# EAGLE schematic teensy-jst_01.2 v7 (EAGLE 9.7.0)
Assembly variants: DNP
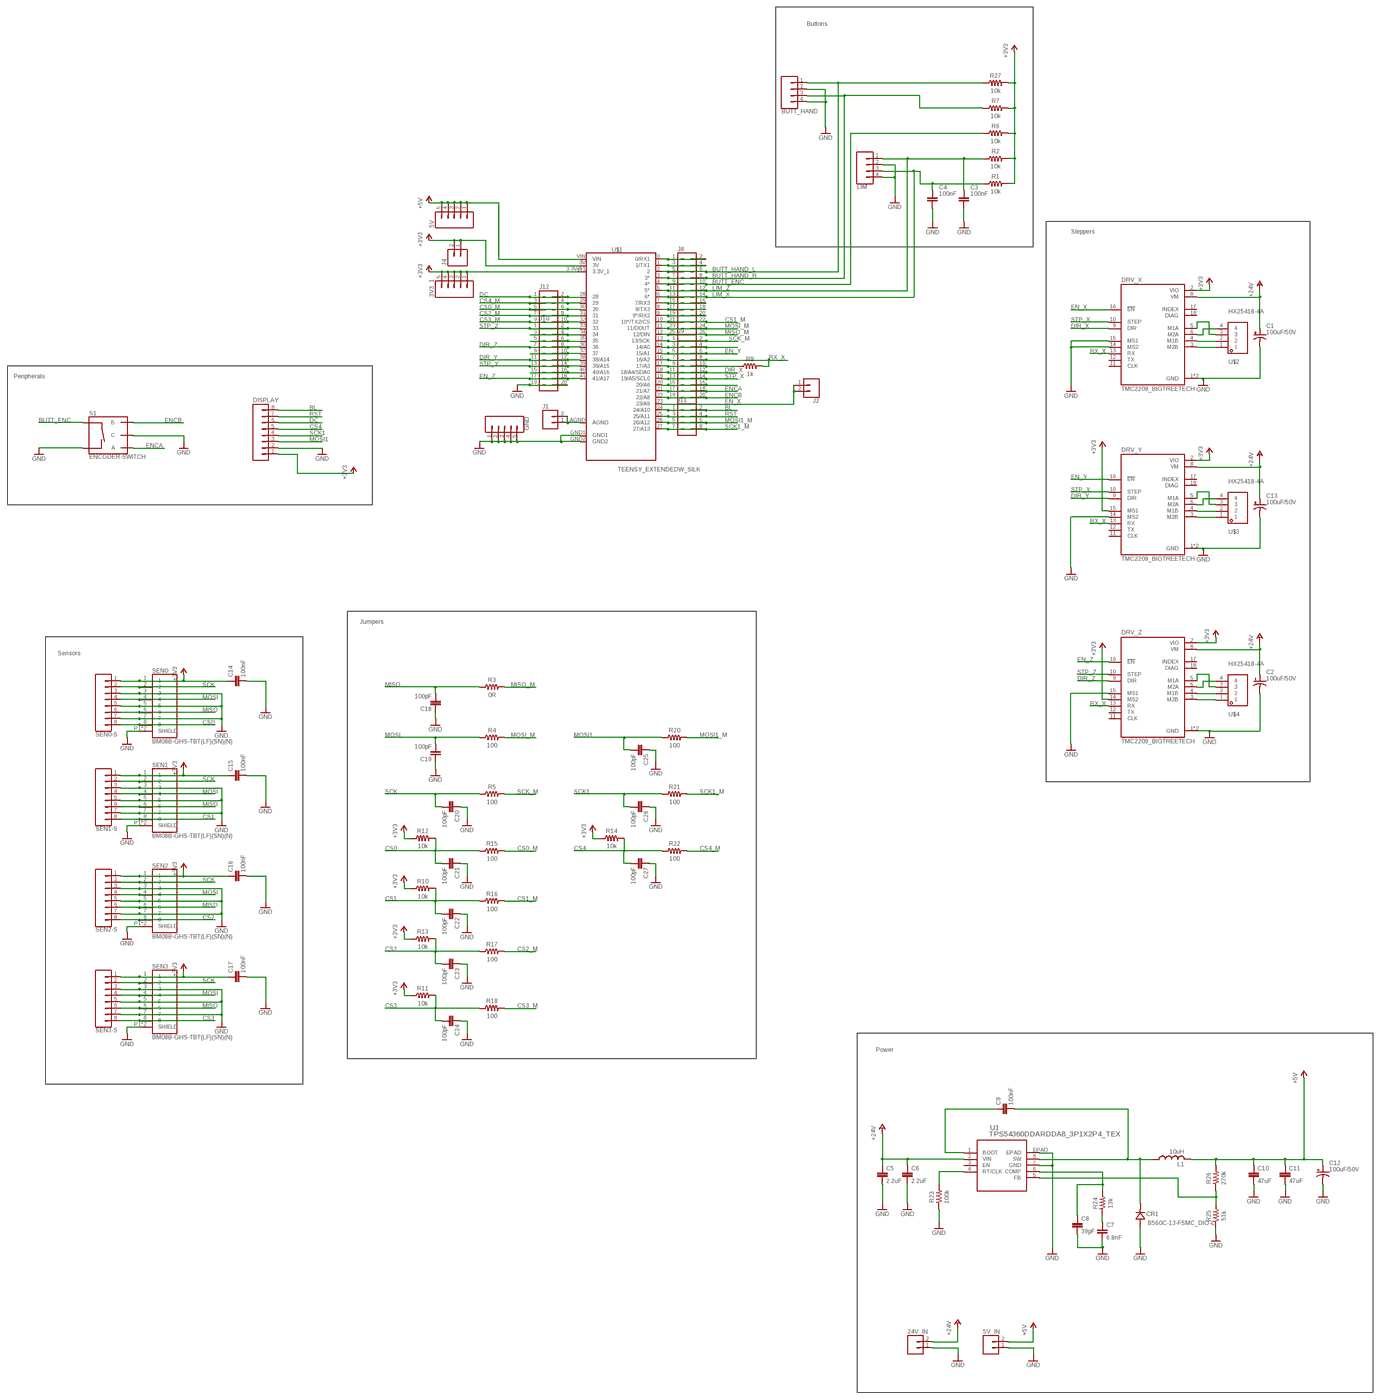
[diagram p0: schematic, sheet 1, overview]
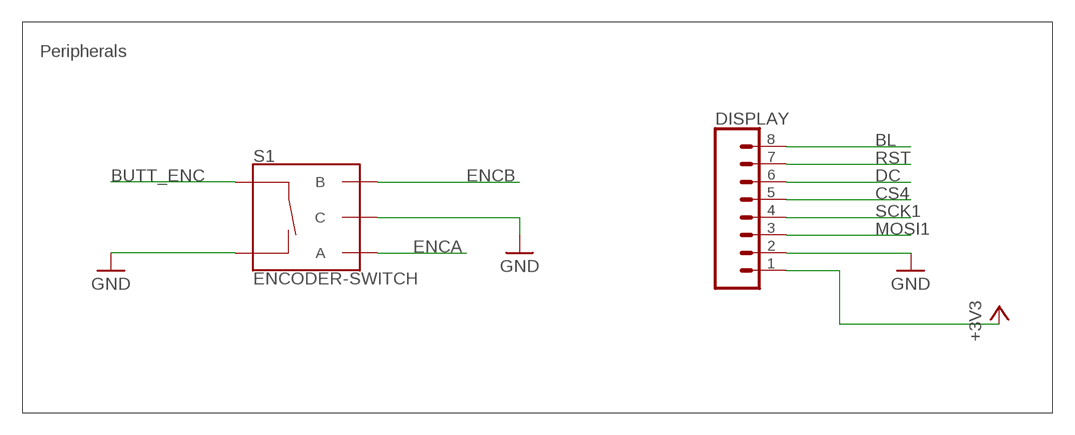
[diagram p1: schematic, sheet 1, part 1 of 4]
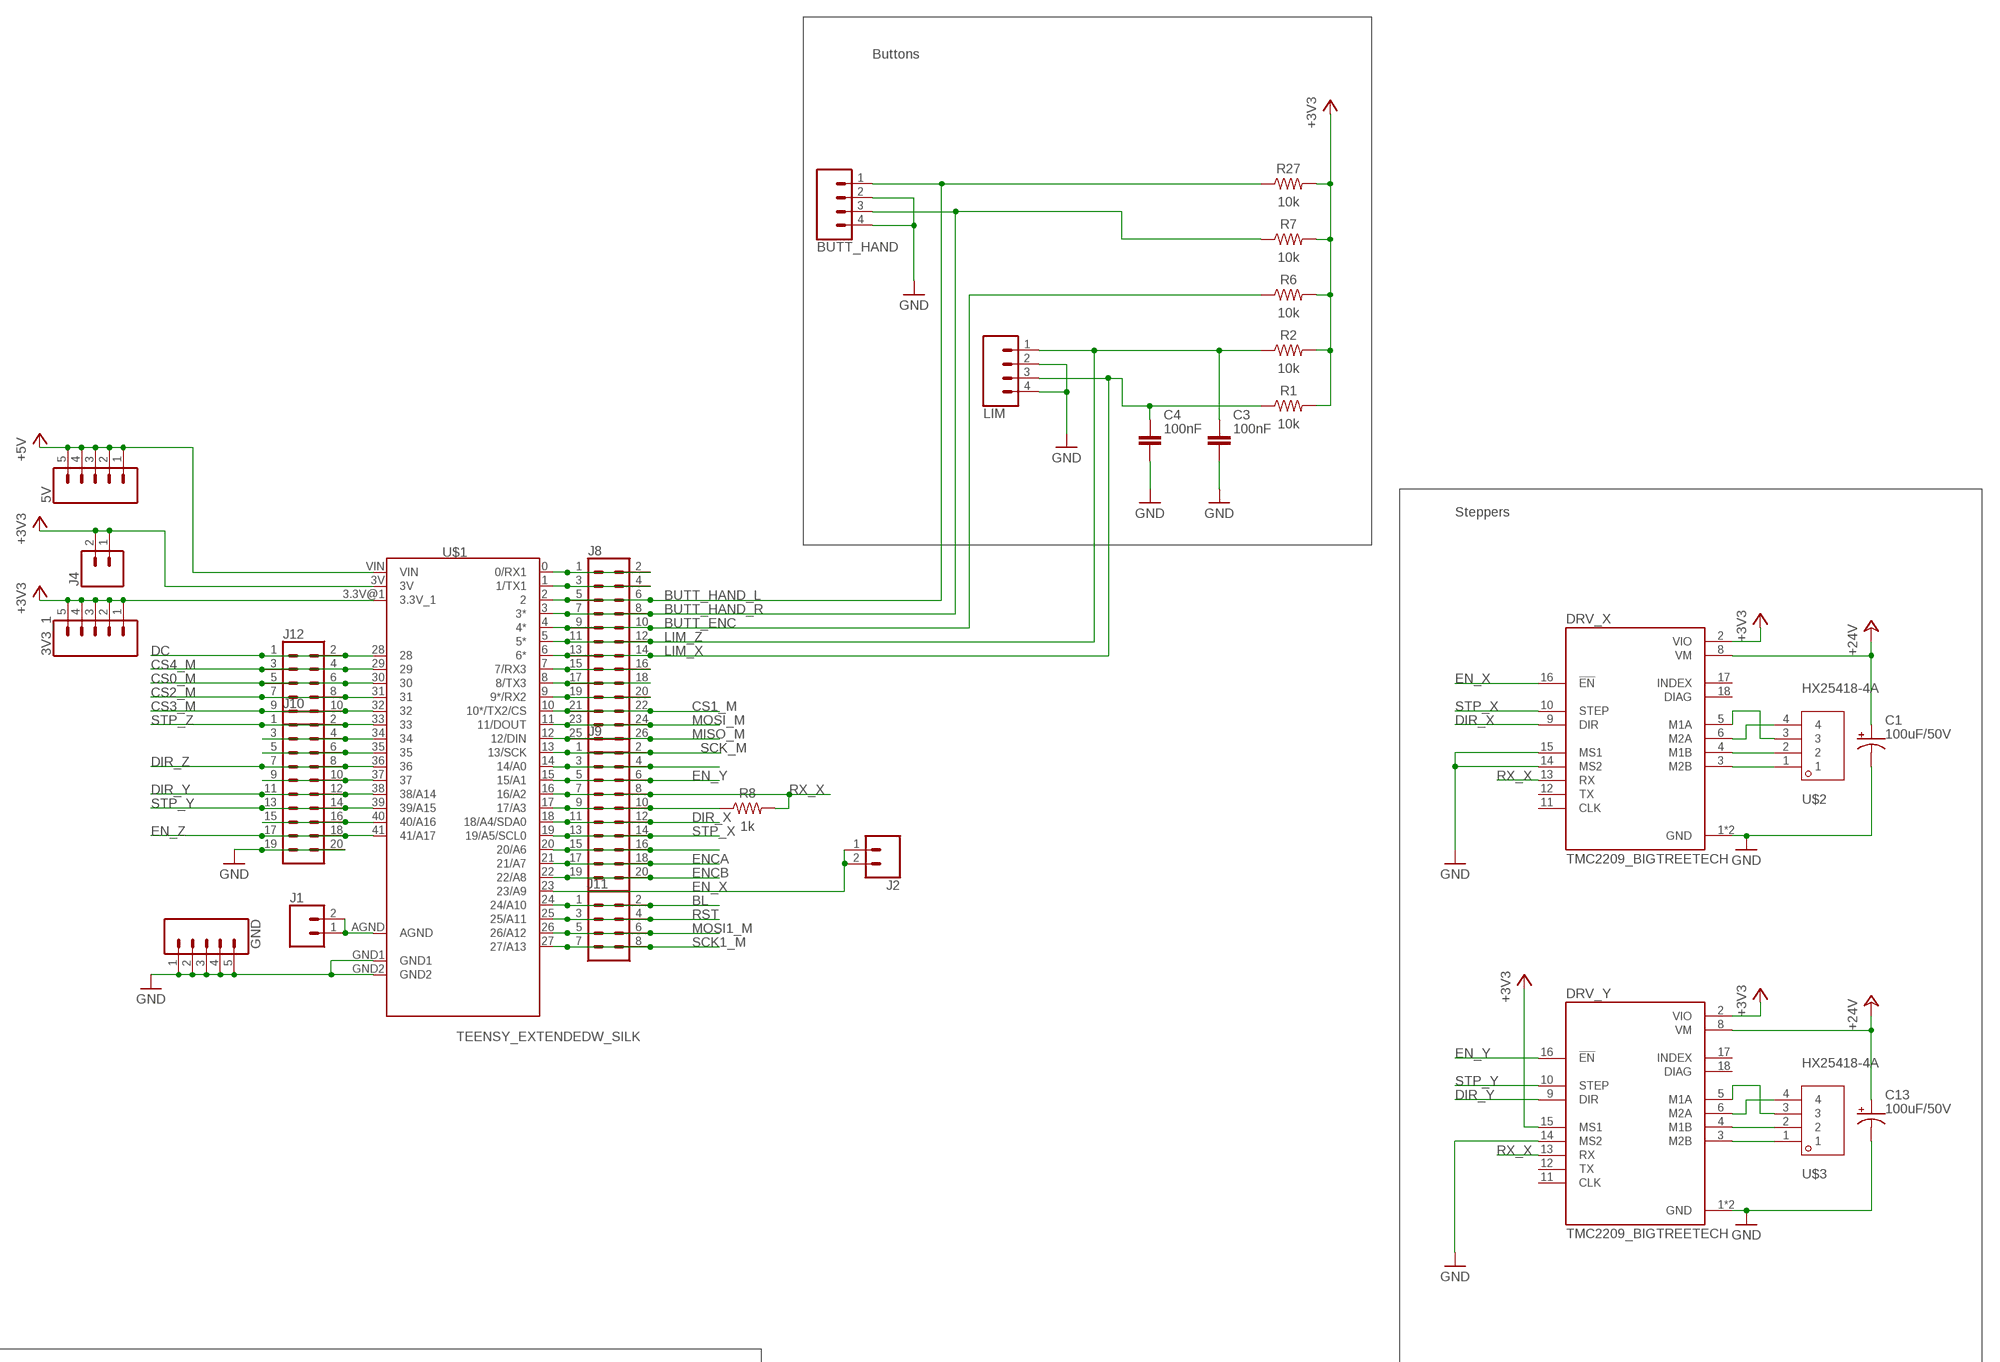
[diagram p2: schematic, sheet 1, part 2 of 4]
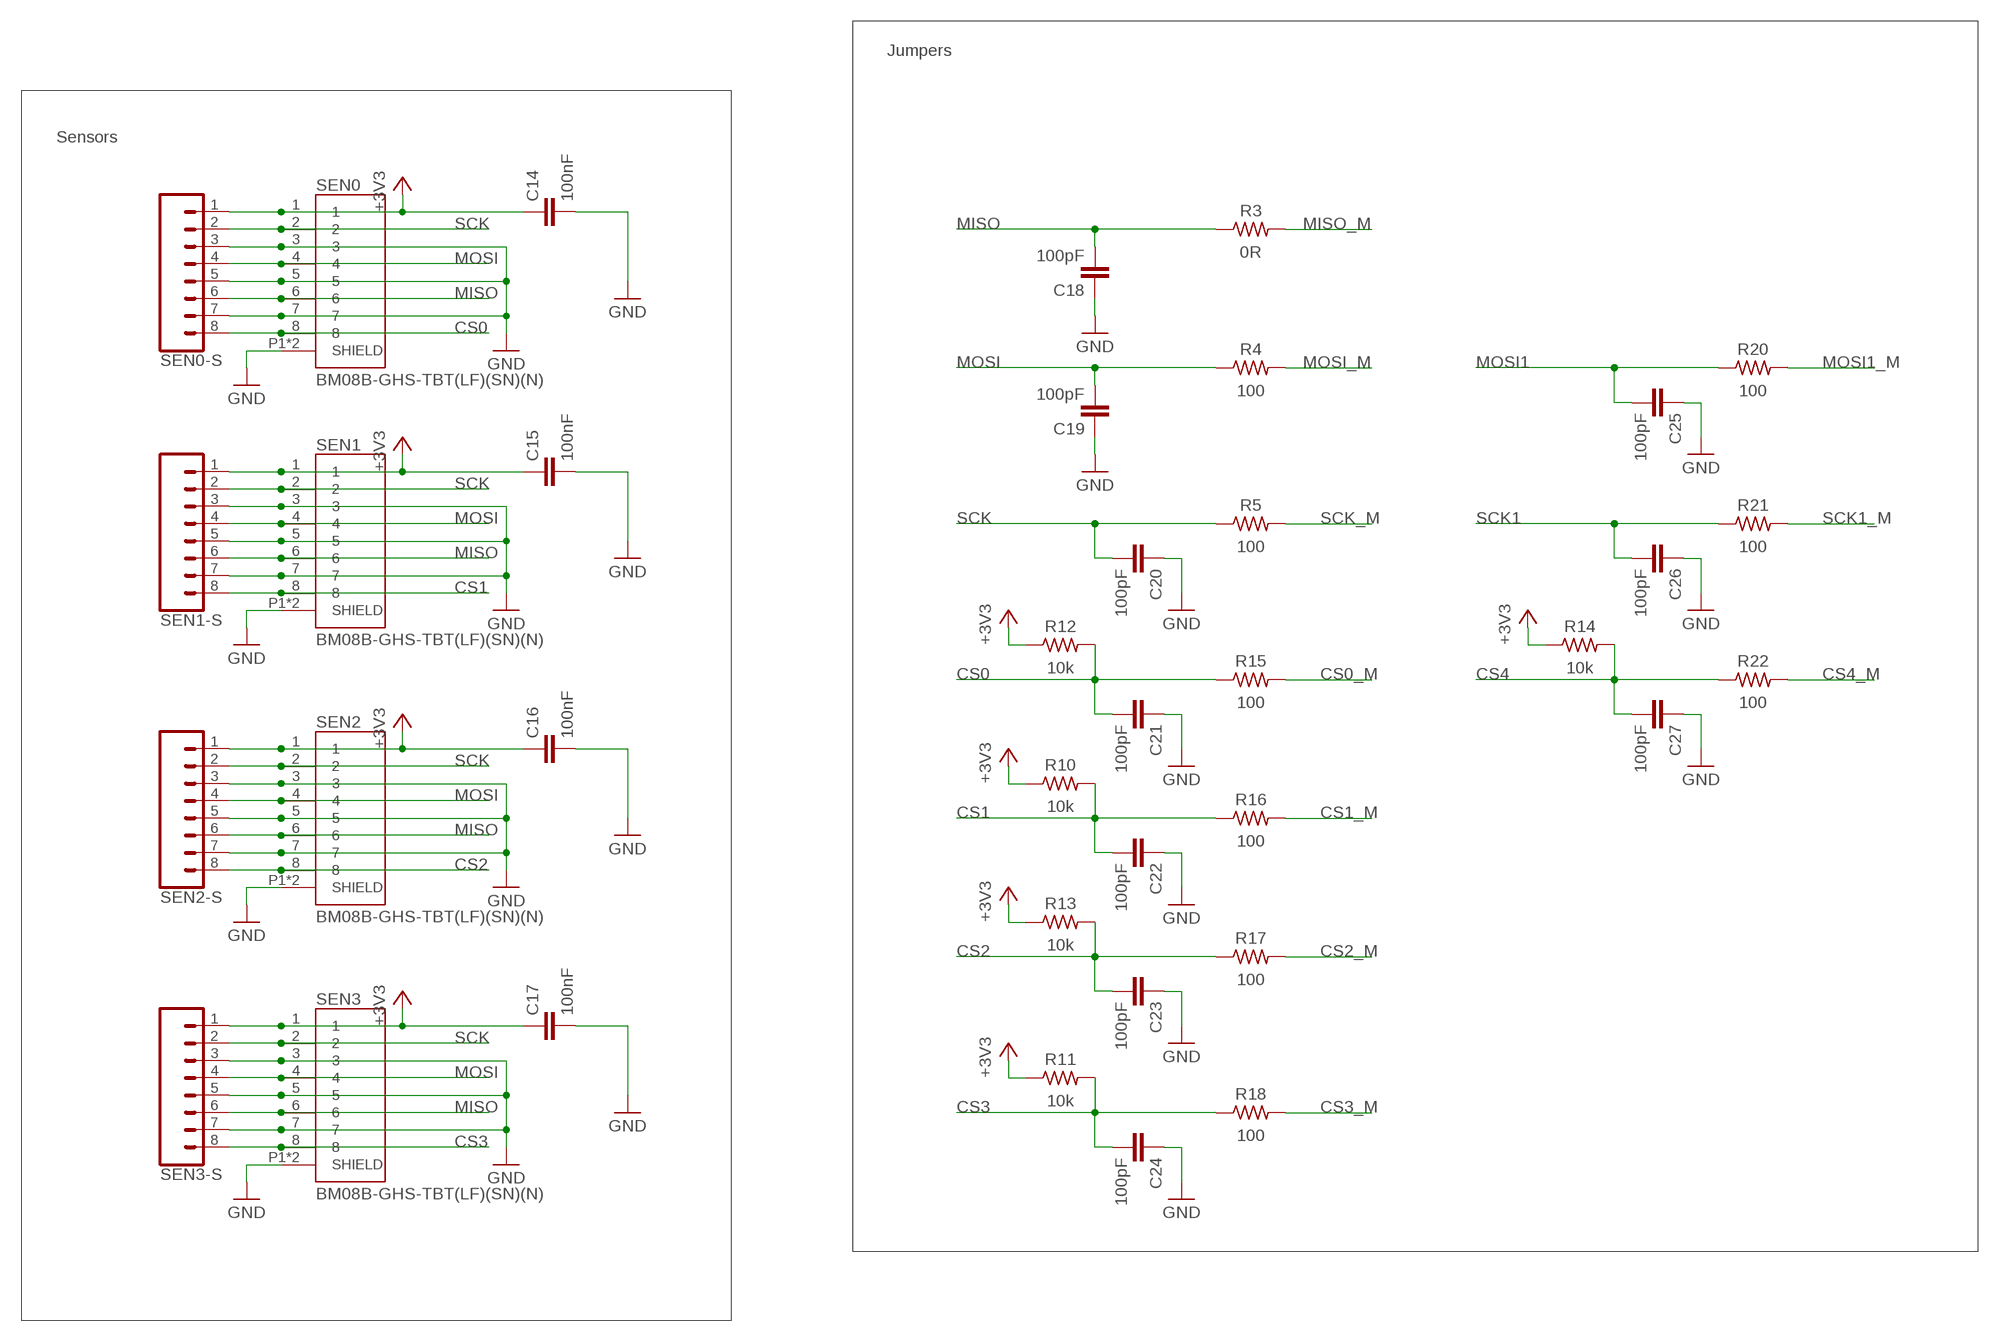
[diagram p3: schematic, sheet 1, part 3 of 4]
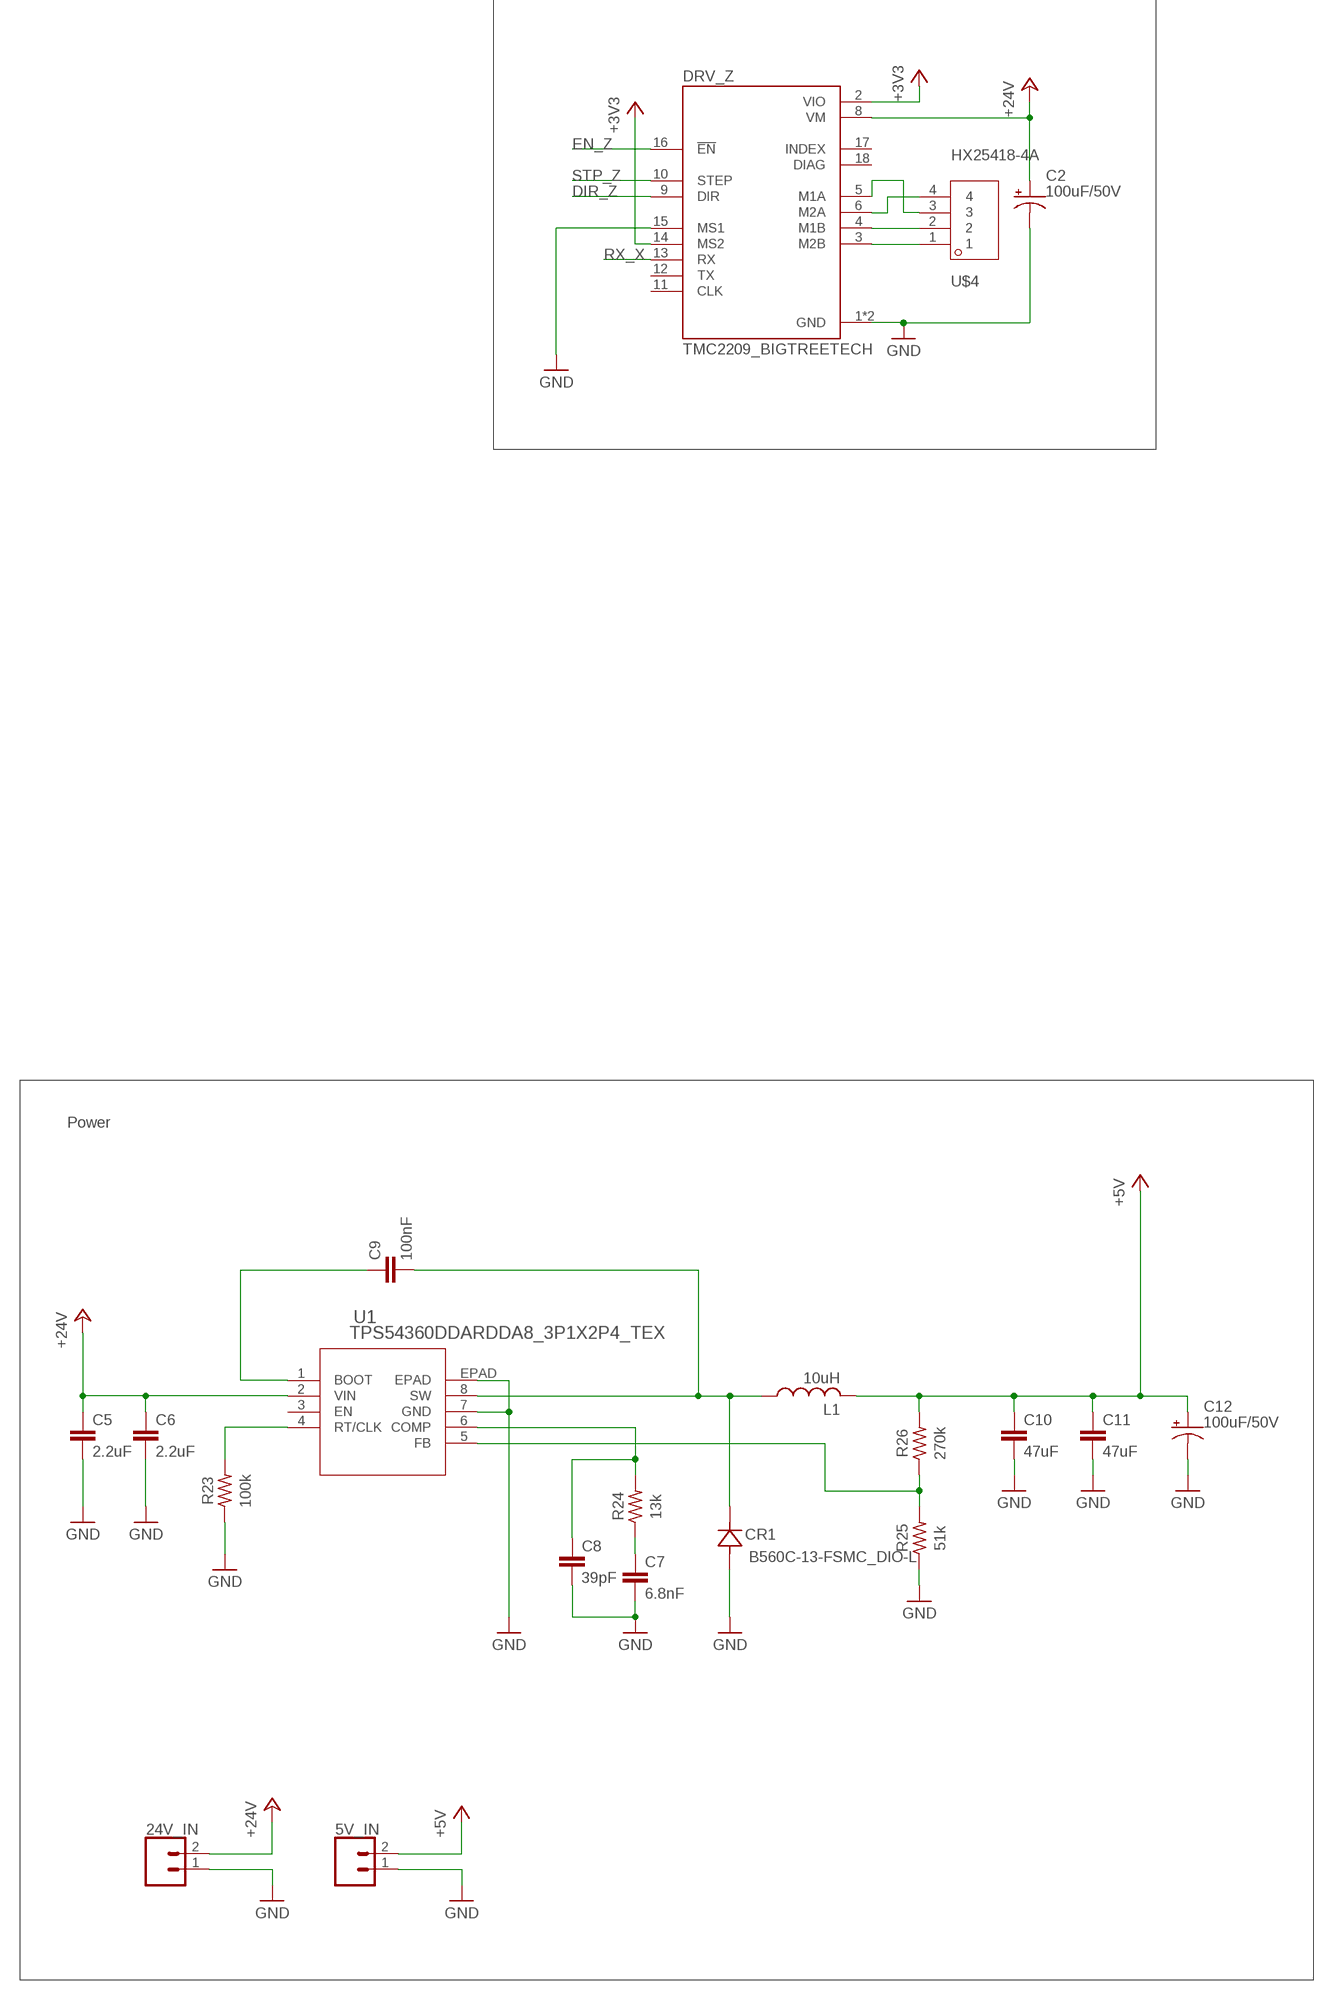
[diagram p4: schematic, sheet 1, part 4 of 4]

## Parts
3V3_1  CONN_05PTH  [1X05]
5V  CONN_05PTH  [1X05]
5V_IN  CONN_025MM  [SCREWTERMINAL-5MM-2]
24V_IN  CONN_025MM  [SCREWTERMINAL-5MM-2]
BUTT_HAND  CONN_041X04_NO_SILK  [1X04_NO_SILK]
C1  100uF/50V  CPOL-USD  [PANASONIC_D]
C2  100uF/50V  CPOL-USD  [PANASONIC_D]
C3  100nF  C-EUC0603  [C0603]
C4  100nF  C-EUC0603  [C0603]
C5  2.2uF  C-EUC0603  [C0603]
C6  2.2uF  C-EUC0603  [C0603]
C7  6.8nF  C-EUC0402  [C0402]
C8  39pF  C-EUC0402  [C0402]
C9  100nF  C-EUC0402  [C0402]
C10  47uF  C-EUC0603  [C0603]
C11  47uF  C-EUC0603  [C0603]
C12  100uF/50V  CPOL-USD  [PANASONIC_D]
C13  100uF/50V  CPOL-USD  [PANASONIC_D]
C14  100nF  C-EUC0402  [C0402]
C15  100nF  C-EUC0402  [C0402]
C16  100nF  C-EUC0402  [C0402]
C17  100nF  C-EUC0402  [C0402]
C18  100pF  C-EUC0402K  [C0402K]  (not fitted in variant DNP)
C19  100pF  C-EUC0402K  [C0402K]  (not fitted in variant DNP)
C20  100pF  C-EUC0402K  [C0402K]  (not fitted in variant DNP)
C21  100pF  C-EUC0402K  [C0402K]  (not fitted in variant DNP)
C22  100pF  C-EUC0402  [C0402]  (not fitted in variant DNP)
C23  100pF  C-EUC0402K  [C0402K]  (not fitted in variant DNP)
C24  100pF  C-EUC0402K  [C0402K]  (not fitted in variant DNP)
C25  100pF  C-EUC0402K  [C0402K]  (not fitted in variant DNP)
C26  100pF  C-EUC0402K  [C0402K]  (not fitted in variant DNP)
C27  100pF  C-EUC0402K  [C0402K]  (not fitted in variant DNP)
CR1  B560C-13-FSMC_DIO-L  [SMC_DIO-L]
DISPLAY  CONN_08"  [1X08]
DRV_X  TMC2209_BIGTREETECH  [MODULE_TMC2209_BIGTREETECH]
DRV_Y  TMC2209_BIGTREETECH  [MODULE_TMC2209_BIGTREETECH]
DRV_Z  TMC2209_BIGTREETECH  [MODULE_TMC2209_BIGTREETECH]
GND  CONN_05PTH  [1X05]
J1  CONN_02  [1X02]
J2  CONN_02  [1X02]
J4  CONN_02  [1X02]
J8  CONN_13X22X13  [2X13]
J9  CONN_10X2  [2X10]
J10  CONN_10X2  [2X10]
J11  CONN_04X2  [2X4]
J12  CONN_05X2PTH  [2X5]
L1  10uH  L-USMWSA0503S-100MT  [MWSA0503S-100MT]
LIM  CONN_041X04_NO_SILK  [1X04_NO_SILK]
R1  10k  R-US_CHIP-0603(1608-METRIC)  [RESC1608X60]
R2  10k  R-US_CHIP-0603(1608-METRIC)  [RESC1608X60]
R3  0R  R-US_CHIP-0603(1608-METRIC)  [RESC1608X60]
R4  100  R-US_CHIP-0603(1608-METRIC)  [RESC1608X60]
R5  100  R-US_CHIP-0603(1608-METRIC)  [RESC1608X60]
R6  10k  R-US_CHIP-0603(1608-METRIC)  [RESC1608X60]
R7  10k  R-US_CHIP-0603(1608-METRIC)  [RESC1608X60]
R8  1k  R-US_CHIP-0603(1608-METRIC)  [RESC1608X60]
R10  10k  R-US_CHIP-0603(1608-METRIC)  [RESC1608X60]
R11  10k  R-US_CHIP-0603(1608-METRIC)  [RESC1608X60]
R12  10k  R-US_CHIP-0603(1608-METRIC)  [RESC1608X60]
R13  10k  R-US_CHIP-0603(1608-METRIC)  [RESC1608X60]
R14  10k  R-US_CHIP-0603(1608-METRIC)  [RESC1608X60]
R15  100  R-US_CHIP-0603(1608-METRIC)  [RESC1608X60]
R16  100  R-US_CHIP-0603(1608-METRIC)  [RESC1608X60]
R17  100  R-US_CHIP-0603(1608-METRIC)  [RESC1608X60]
R18  100  R-US_CHIP-0603(1608-METRIC)  [RESC1608X60]
R20  100  R-US_CHIP-0603(1608-METRIC)  [RESC1608X60]
R21  100  R-US_CHIP-0603(1608-METRIC)  [RESC1608X60]
R22  100  R-US_CHIP-0603(1608-METRIC)  [RESC1608X60]
R23  100k  R-US_CHIP-0402(1005-METRIC)  [RESC1005X40]
R24  13k  R-US_CHIP-0402(1005-METRIC)  [RESC1005X40]
R25  51k  R-US_CHIP-0402(1005-METRIC)  [RESC1005X40]
R26  270k  R-US_CHIP-0402(1005-METRIC)  [RESC1005X40]
R27  10k  R-US_CHIP-0603(1608-METRIC)  [RESC1608X60]
S1  ENCODER-SWITCH  [ROTARY_ENC_PLAIN]
SEN0  BM08B-GHS-TBT(LF)(SN)(N)  [JST_BM08B-GHS-TBT(LF)(SN)(N)]
SEN0-S  CONN_08"  [1X08]
SEN1  BM08B-GHS-TBT(LF)(SN)(N)  [JST_BM08B-GHS-TBT(LF)(SN)(N)]
SEN1-S  CONN_08"  [1X08]
SEN2  BM08B-GHS-TBT(LF)(SN)(N)  [JST_BM08B-GHS-TBT(LF)(SN)(N)]
SEN2-S  CONN_08"  [1X08]
SEN3  BM08B-GHS-TBT(LF)(SN)(N)  [JST_BM08B-GHS-TBT(LF)(SN)(N)]
SEN3-S  CONN_08"  [1X08]
U1  TPS54360DDARDDA8_3P1X2P4_TEX  [DDA8_3P1X2P4_TEX]
U$1  TEENSY_EXTENDEDW_SILK  [TEENSY_EXTENDED]
U$2  HX25418-4A  [HX25418-4A]
U$3  HX25418-4A  [HX25418-4A]
U$4  HX25418-4A  [HX25418-4A]

## Nets
+3V3: 3V3_1.1 3V3_1.2 3V3_1.3 3V3_1.4 3V3_1.5 C14.1 C15.1 C16.1 C17.1 DISPLAY.1 DRV_X.2(VIO) DRV_Y.2(VIO) DRV_Y.15(MS1) DRV_Z.2(VIO) DRV_Z.14(MS2) J4.1 J4.2 R1.2 R2.2 R6.2 R7.2 R10.1 R11.1 R12.1 R13.1 R14.1 R27.2 SEN0-S.1 SEN0.1 SEN1-S.1 SEN1.1 SEN2-S.1 SEN2.1 SEN3-S.1 SEN3.1 U$1.3.3V@1(3.3V_1) U$1.3V
+5V: 5V.1 5V.2 5V.3 5V.4 5V.5 5V_IN.2 C10.1 C11.1 C12.+ L1.2 R26.2 U$1.VIN
+24V: 24V_IN.2 C1.+ C2.+ C5.1 C6.1 C13.+ DRV_X.8(VM) DRV_Y.8(VM) DRV_Z.8(VM) U1.2(VIN)
BL: DISPLAY.8 J11.1 J11.2 U$1.24(24/A10)
BUTT_ENC: J8.9 J8.10 R6.1 S1.SW+ U$1.4(4*)
BUTT_HAND_L: BUTT_HAND.1 J8.5 J8.6 R27.1 U$1.2
BUTT_HAND_R: BUTT_HAND.3 J8.7 J8.8 R7.1 U$1.3(3*)
CS0: C21.2 R12.2 R15.1 SEN0-S.8 SEN0.8
CS0_M: J12.5 J12.6 R15.2 U$1.30
CS1: C22.2 R10.2 R16.1 SEN1-S.8 SEN1.8
CS1_M: J8.21 J8.22 R16.2 U$1.10(10*/TX2/CS)
CS2: C23.2 R13.2 R17.1 SEN2-S.8 SEN2.8
CS2_M: J12.7 J12.8 R17.2 U$1.31
CS3: C24.2 R11.2 R18.1 SEN3-S.8 SEN3.8
CS3_M: J12.9 J12.10 R18.2 U$1.32
CS4: C27.2 DISPLAY.5 R14.2 R22.1
CS4_M: J12.3 J12.4 R22.2 U$1.29
DC: DISPLAY.6 J12.1 J12.2 U$1.28
DIR_X: DRV_X.9(DIR) J9.11 J9.12 U$1.18(18/A4/SDA0)
DIR_Y: DRV_Y.9(DIR) J10.11 J10.12 U$1.38(38/A14)
DIR_Z: DRV_Z.9(DIR) J10.7 J10.8 U$1.36
EN_X: DRV_X.16(!EN) J2.1 J2.2 U$1.23(23/A9)
EN_Y: DRV_Y.16(!EN) J9.5 J9.6 U$1.15(15/A1)
EN_Z: DRV_Z.16(!EN) J10.17 J10.18 U$1.41(41/A17)
ENCA: J9.17 J9.18 S1.A U$1.21(21/A7)
ENCB: J9.19 J9.20 S1.B U$1.22(22/A8)
GND: 5V_IN.1 24V_IN.1 BUTT_HAND.2 BUTT_HAND.4 C1.- C2.- C3.2 C4.2 C5.2 C6.2 C7.2 C8.2 C10.2 C11.2 C12.- C13.- C14.2 C15.2 C16.2 C17.2 C18.1 C19.1 C20.1 C21.1 C22.1 C23.1 C24.1 C25.1 C26.1 C27.1 CR1.2 DISPLAY.2 DRV_X.1(GND) DRV_X.7(GND) DRV_X.14(MS2) DRV_X.15(MS1) DRV_Y.1(GND) DRV_Y.7(GND) DRV_Y.14(MS2) DRV_Z.1(GND) DRV_Z.7(GND) DRV_Z.15(MS1) GND.1 GND.2 GND.3 GND.4 GND.5 J10.19 J10.20 LIM.2 LIM.4 R23.1 R25.1 S1.C S1.SW- SEN0-S.3 SEN0-S.5 SEN0-S.7 SEN0.3 SEN0.5 SEN0.7 SEN0.P1(SHIELD) SEN0.P2(SHIELD) SEN1-S.3 SEN1-S.5 SEN1-S.7 SEN1.3 SEN1.5 SEN1.7 SEN1.P1(SHIELD) SEN1.P2(SHIELD) SEN2-S.3 SEN2-S.5 SEN2-S.7 SEN2.3 SEN2.5 SEN2.7 SEN2.P1(SHIELD) SEN2.P2(SHIELD) SEN3-S.3 SEN3-S.5 SEN3-S.7 SEN3.3 SEN3.5 SEN3.7 SEN3.P1(SHIELD) SEN3.P2(SHIELD) U1.7(GND) U1.EPAD U$1.GND1 U$1.GND2
LIM_X: C4.1 J8.13 J8.14 LIM.3 R1.1 U$1.6(6*)
LIM_Z: C3.1 J8.11 J8.12 LIM.1 R2.1 U$1.5(5*)
MISO: C18.2 R3.1 SEN0-S.6 SEN0.6 SEN1-S.6 SEN1.6 SEN2-S.6 SEN2.6 SEN3-S.6 SEN3.6
MISO1: J8.3 J8.4 U$1.1(1/TX1)
MISO_M: J8.25 J8.26 R3.2 U$1.12(12/DIN)
MOSI: C19.2 R4.1 SEN0-S.4 SEN0.4 SEN1-S.4 SEN1.4 SEN2-S.4 SEN2.4 SEN3-S.4 SEN3.4
MOSI1: C25.2 DISPLAY.3 R20.1
MOSI1_M: J11.5 J11.6 R20.2 U$1.26(26/A12)
MOSI_M: J8.23 J8.24 R4.2 U$1.11(11/DOUT)
MS1_Z: J10.9 J10.10 U$1.37
N$1: J10.15 J10.16 U$1.40(40/A16)
N$3: J9.3 J9.4 U$1.14(14/A0)
N$4: J1.1 J1.2 U$1.AGND
N$7: R23.2 U1.4(RT/CLK)
N$8: J8.15 J8.16 U$1.7(7/RX3)
N$10: C7.1 R24.1
N$12: DRV_Z.6(M2A) U$4.4
N$14: C8.1 R24.2 U1.6(COMP)
N$15: DRV_Z.5(M1A) U$4.3
N$17: DRV_X.6(M2A) U$2.4
N$18: DRV_X.5(M1A) U$2.3
N$19: R25.2 R26.1 U1.5(FB)
N$20: DRV_Z.4(M1B) U$4.2
N$21: DRV_Z.3(M2B) U$4.1
N$23: DRV_Y.4(M1B) U$3.2
N$24: DRV_X.4(M1B) U$2.2
N$25: DRV_X.3(M2B) U$2.1
N$26: J9.15 J9.16 U$1.20(20/A6)
N$28: J9.9 J9.10 R8.1 U$1.17(17/A3)
N$29: DRV_Y.3(M2B) U$3.1
N$30: C9.2 CR1.1 L1.1 U1.8(SW)
N$32: C9.1 U1.1(BOOT)
N$33: J8.17 J8.18 U$1.8(8/TX3)
N$36: DRV_Y.6(M2A) U$3.4
N$37: J8.1 J8.2 U$1.0(0/RX1)
N$38: DRV_Y.5(M1A) U$3.3
N$39: J8.19 J8.20 U$1.9(9*/RX2)
N$41: J10.5 J10.6 U$1.35
RST: DISPLAY.7 J11.3 J11.4 U$1.25(25/A11)
RX_X: DRV_X.13(RX) DRV_Y.13(RX) DRV_Z.13(RX) J9.7 J9.8 R8.2 U$1.16(16/A2)
RX_Z: J10.3 J10.4 U$1.34
SCK: C20.2 R5.1 SEN0-S.2 SEN0.2 SEN1-S.2 SEN1.2 SEN2-S.2 SEN2.2 SEN3-S.2 SEN3.2
SCK1: C26.2 DISPLAY.4 R21.1
SCK1_M: J11.7 J11.8 R21.2 U$1.27(27/A13)
SCK_M: J9.1 J9.2 R5.2 U$1.13(13/SCK)
STP_X: DRV_X.10(STEP) J9.13 J9.14 U$1.19(19/A5/SCL0)
STP_Y: DRV_Y.10(STEP) J10.13 J10.14 U$1.39(39/A15)
STP_Z: DRV_Z.10(STEP) J10.1 J10.2 U$1.33
Unconnected: DRV_X.11(CLK) DRV_X.12(TX) DRV_X.17(INDEX) DRV_X.18(DIAG) DRV_Y.11(CLK) DRV_Y.12(TX) DRV_Y.17(INDEX) DRV_Y.18(DIAG) DRV_Z.11(CLK) DRV_Z.12(TX) DRV_Z.17(INDEX) DRV_Z.18(DIAG) U1.3(EN)

## Notes on the sheet
- Buttons
- Steppers
- Peripherals
- Jumpers
- Sensors
- Power

## Library data of the parts
3V3_1 5V GND = SparkFun-Connectors:CONN_05: Multi connection point. Often used as Generic Header-pin footprint for 0.1 inch spaced/style header connections On any of the 0.1 inch spaced packages, you can populate with these: Break Away Headers - Straight <https://www.sparkfun.com/products/116> (PRT-00116) Break Away Male Headers - Right Angle <https://www.sparkfun.com/products/553> (PRT-00553) Female Headers <https://www.sparkfun.com/products/115> (PRT-00115) Break Away Headers - Machine Pin <https://www.sparkfun.com/products/117> (PRT-00117) Break Away Female Headers - Swiss Machine Pin <https://www.sparkfun.com/products/743> (PRT-00743) For SCREWTERMINALS and SPRING TERMINALS visit here: Screw Terimnals on SparkFun.com <https://www.sparkfun.com/search/results?term=Screw+Terminals> (5mm/3.5mm/2.54mm spacing) This device is also useful as a general connection point to wire up your design to another part of your project. Our various solder wires solder well into these plated through hole pads. Hook-Up Wire - Assortment (Stranded, 22 AWG) <https://www.sparkfun.com/products/11375> (PRT-11375) Hook-Up Wire - Assortment (Solid Core, 22 AWG) <https://www.sparkfun.com/products/11367> (PRT-11367) View the entire wire category on our website here <https://www.sparkfun.com/categories/141> Special notes: Molex polarized connector foot print use with SKU : PRT-08231 with associated crimp pins and housings. 1MM SMD Version SKU: PRT-10208
5V_IN 24V_IN = SparkFun-Connectors:CONN_02: Multi connection point. Often used as Generic Header-pin footprint for 0.1 inch spaced/style header connections On any of the 0.1 inch spaced packages, you can populate with these: Break Away Headers - Straight <https://www.sparkfun.com/products/116> (PRT-00116) Break Away Male Headers - Right Angle <https://www.sparkfun.com/products/553> (PRT-00553) Female Headers <https://www.sparkfun.com/products/115> (PRT-00115) Break Away Headers - Machine Pin <https://www.sparkfun.com/products/117> (PRT-00117) Break Away Female Headers - Swiss Machine Pin <https://www.sparkfun.com/products/743> (PRT-00743) For SCREWTERMINALS and SPRING TERMINALS visit here: Screw Terimnals on SparkFun.com <https://www.sparkfun.com/search/results?term=Screw+Terminals> (5mm/3.5mm/2.54mm spacing) This device is also useful as a general connection point to wire up your design to another part of your project. Our various solder wires solder well into these plated through hole pads. Hook-Up Wire - Assortment (Stranded, 22 AWG) <https://www.sparkfun.com/products/11375> (PRT-11375) Hook-Up Wire - Assortment (Solid Core, 22 AWG) <https://www.sparkfun.com/products/11367> (PRT-11367) View the entire wire category on our website here <https://www.sparkfun.com/categories/141> Special notes: Molex polarized connector foot print use with: PRT-08233 with associated crimp pins and housings. 2.54_SCREWTERM for use with PRT-10571. 3.5mm Screw Terminal footprints for PRT-08084 5mm Screw Terminal footprints for use with PRT-08432; SF_SKU: PRT-08432
BUTT_HAND LIM = SparkFun-Connectors:CONN_04: Multi connection point. Often used as Generic Header-pin footprint for 0.1 inch spaced/style header connections On any of the 0.1 inch spaced packages, you can populate with these: Break Away Headers - Straight <https://www.sparkfun.com/products/116> (PRT-00116) Break Away Male Headers - Right Angle <https://www.sparkfun.com/products/553> (PRT-00553) Female Headers <https://www.sparkfun.com/products/115> (PRT-00115) Break Away Headers - Machine Pin <https://www.sparkfun.com/products/117> (PRT-00117) Break Away Female Headers - Swiss Machine Pin <https://www.sparkfun.com/products/743> (PRT-00743) For SCREWTERMINALS and SPRING TERMINALS visit here: Screw Terimnals on SparkFun.com <https://www.sparkfun.com/search/results?term=Screw+Terminals> (5mm/3.5mm/2.54mm spacing) This device is also useful as a general connection point to wire up your design to another part of your project. Our various solder wires solder well into these plated through hole pads. Hook-Up Wire - Assortment (Stranded, 22 AWG) <https://www.sparkfun.com/products/11375> (PRT-11375) Hook-Up Wire - Assortment (Solid Core, 22 AWG) <https://www.sparkfun.com/products/11367> (PRT-11367) View the entire wire category on our website here <https://www.sparkfun.com/categories/141> Special notes: Molex polarized connector foot print use with SKU : PRT-08231 with associated crimp pins and housings. 1MM SMD Version SKU: PRT-10208; PROD_ID: CONN-09696
C1 C2 C12 C13 = rcl:CPOL-US: POLARIZED CAPACITOR, American symbol; SPICEPREFIX: C
C3-C11 C14-C27 = rcl:C-EU: CAPACITOR, European symbol; SPICEPREFIX: C
CR1 = 2024-09-23_20-34-24_Library:B560C-13-F; COPYRIGHT: Copyright (C) 2024 Ultra Librarian. All rights reserved.; MANUFACTURER_PART_NUMBER: B560C-13-F; MFR_NAME: Diodes Inc
DISPLAY SEN0-S SEN1-S SEN2-S SEN3-S = SparkFun-Connectors:CONN_08: Multi connection point. Often used as Generic Header-pin footprint for 0.1 inch spaced/style header connections On any of the 0.1 inch spaced packages, you can populate with these: Break Away Headers - Straight <https://www.sparkfun.com/products/116> (PRT-00116) Break Away Male Headers - Right Angle <https://www.sparkfun.com/products/553> (PRT-00553) Female Headers <https://www.sparkfun.com/products/115> (PRT-00115) Break Away Headers - Machine Pin <https://www.sparkfun.com/products/117> (PRT-00117) Break Away Female Headers - Swiss Machine Pin <https://www.sparkfun.com/products/743> (PRT-00743) Arduino Stackable Header - 8 Pin <https://www.sparkfun.com/products/9279> (PRT-09279) For SCREWTERMINALS and SPRING TERMINALS visit here: Screw Terimnals on SparkFun.com <https://www.sparkfun.com/search/results?term=Screw+Terminals> (5mm/3.5mm/2.54mm spacing) This device is also useful as a general connection point to wire up your design to another part of your project. Our various solder wires solder well into these plated through hole pads. Hook-Up Wire - Assortment (Stranded, 22 AWG) <https://www.sparkfun.com/products/11375> (PRT-11375) Hook-Up Wire - Assortment (Solid Core, 22 AWG) <https://www.sparkfun.com/products/11367> (PRT-11367) View the entire wire category on our website here <https://www.sparkfun.com/categories/141> Special notes: Molex polarized connector foot print use with SKU : PRT-08231 with associated crimp pins and housings. 1MM SMD Version SKU: PRT-10208 NOTES ON THE VARIANTS LOCK and LOCK_LONGPADS... This footprint was designed to help hold the alignment of a through-hole component (i.e. 6-pin header) while soldering it into place. You may notice that each hole has been shifted either up or down by 0.005 of an inch from it's more standard position (which is a perfectly straight line). This slight alteration caused the pins (the squares in the middle) to touch the edges of the holes. Because they are alternating, it causes a "brace" to hold the component in place. 0.005 has proven to be the perfect amount of "off-center" position when using our standard breakaway headers. Although looks a little odd when you look at the bare footprint, once you have a header in there, the alteration is very hard to notice. Also,if you push a header all the way into place, it is covered up entirely on the bottom side.; PROD_ID: CONN-08438
DRV_X DRV_Y DRV_Z = TMC2209_BIGTREETECH:TMC2209_BIGTREETECH: Check availability <https://pricing.snapeda.com/parts/TMC2209%20SILENTSTEPSTICK/Trinamic%20Motion%20Control%20GmbH/view-part?ref=eda>; AVAILABILITY: In Stock; CHECK_PRICES: https://www.snapeda.com/parts/TMC2209%20SILENTSTEPSTICK/Trinamic+Motion+Control+GmbH/view-part/?ref=eda; DESCRIPTION: TMC2209 Motor Controller/Driver Power Management Evaluation Board; MF: Trinamic Motion Control GmbH; MP: TMC2209 SILENTSTEPSTICK; PACKAGE: None; PRICE: None; SNAPEDA_LINK: https://www.snapeda.com/parts/TMC2209%20SILENTSTEPSTICK/Trinamic+Motion+Control+GmbH/view-part/?ref=snap
J1 J2 J4 = SparkFun-Connectors:CONN_02: Multi connection point. Often used as Generic Header-pin footprint for 0.1 inch spaced/style header connections On any of the 0.1 inch spaced packages, you can populate with these: Break Away Headers - Straight <https://www.sparkfun.com/products/116> (PRT-00116) Break Away Male Headers - Right Angle <https://www.sparkfun.com/products/553> (PRT-00553) Female Headers <https://www.sparkfun.com/products/115> (PRT-00115) Break Away Headers - Machine Pin <https://www.sparkfun.com/products/117> (PRT-00117) Break Away Female Headers - Swiss Machine Pin <https://www.sparkfun.com/products/743> (PRT-00743) For SCREWTERMINALS and SPRING TERMINALS visit here: Screw Terimnals on SparkFun.com <https://www.sparkfun.com/search/results?term=Screw+Terminals> (5mm/3.5mm/2.54mm spacing) This device is also useful as a general connection point to wire up your design to another part of your project. Our various solder wires solder well into these plated through hole pads. Hook-Up Wire - Assortment (Stranded, 22 AWG) <https://www.sparkfun.com/products/11375> (PRT-11375) Hook-Up Wire - Assortment (Solid Core, 22 AWG) <https://www.sparkfun.com/products/11367> (PRT-11367) View the entire wire category on our website here <https://www.sparkfun.com/categories/141> Special notes: Molex polarized connector foot print use with: PRT-08233 with associated crimp pins and housings. 2.54_SCREWTERM for use with PRT-10571. 3.5mm Screw Terminal footprints for PRT-08084 5mm Screw Terminal footprints for use with PRT-08432
J8 = SparkFun-Connectors:CONN_13X2: Multi connection point. Often used as Generic Header-pin footprint for 0.1 inch spaced/style header connections On any of the 0.1 inch spaced packages, you can populate with these: Break Away Headers - Straight <https://www.sparkfun.com/products/116> (PRT-00116) Break Away Male Headers - Right Angle <https://www.sparkfun.com/products/553> (PRT-00553) Female Headers <https://www.sparkfun.com/products/115> (PRT-00115) Break Away Headers - Machine Pin <https://www.sparkfun.com/products/117> (PRT-00117) Break Away Female Headers - Swiss Machine Pin <https://www.sparkfun.com/products/743> (PRT-00743)
J9 J10 = SparkFun-Connectors:CONN_10X2: Multi connection point. Often used as Generic Header-pin footprint for 0.1 inch spaced/style header connections On any of the 0.1 inch spaced packages, you can populate with these: Break Away Headers - Straight <https://www.sparkfun.com/products/116> (PRT-00116) Break Away Male Headers - Right Angle <https://www.sparkfun.com/products/553> (PRT-00553) Female Headers <https://www.sparkfun.com/products/115> (PRT-00115) Break Away Headers - Machine Pin <https://www.sparkfun.com/products/117> (PRT-00117) Break Away Female Headers - Swiss Machine Pin <https://www.sparkfun.com/products/743> (PRT-00743) Special note about the "SPECIAL" package: This was SPECIALLY designed to be used with our Graphic LCD Backpack. Be sure you want to use this! It is not only staggered on each line of header holes, but IT IS ALSO offset of the center point of the top and bottom lines by 5 mil. This causes the headers to lock into place on the "standard" footprint on the LCD screen. The extra squares on the tdocu layer are there simply to reference other pins (if you were to actually populate a longer header than ten long - this is what we do with the backpacks).
J11 = SparkFun-Connectors:CONN_04X2: Multi connection point. Often used as Generic Header-pin footprint for 0.1 inch spaced/style header connections On any of the 0.1 inch spaced packages, you can populate with these: Break Away Headers - Straight <https://www.sparkfun.com/products/116> (PRT-00116) Break Away Male Headers - Right Angle <https://www.sparkfun.com/products/553> (PRT-00553) Female Headers <https://www.sparkfun.com/products/115> (PRT-00115) Break Away Headers - Machine Pin <https://www.sparkfun.com/products/117> (PRT-00117) Break Away Female Headers - Swiss Machine Pin <https://www.sparkfun.com/products/743> (PRT-00743)
J12 = SparkFun-Connectors:CONN_05X2: Multi connection point. Often used as Generic Header-pin footprint for 0.1 inch spaced/style header connections For AVR SPI programming port, see special device with nice symbol: "AVR_SPI_PROG_5x2.dev" You can populate with any combo of single row headers, but if you'd like an exact match, check these: 2x5 AVR ICSP Male Header <https://www.sparkfun.com/products/778> (PRT-00778) 2x5 Pin Shrouded Header <https://www.sparkfun.com/products/8506> (PRT-08506) On any of the 0.1 inch spaced packages, you can populate with these: Break Away Headers - Straight <https://www.sparkfun.com/products/116> (PRT-00116) Break Away Male Headers - Right Angle <https://www.sparkfun.com/products/553> (PRT-00553) Female Headers <https://www.sparkfun.com/products/115> (PRT-00115) Break Away Headers - Machine Pin <https://www.sparkfun.com/products/117> (PRT-00117) Break Away Female Headers - Swiss Machine Pin <https://www.sparkfun.com/products/743> (PRT-00743) Special note: the shrouded connector mates well with our 5x2 ribbon cables: 2x5 Pin IDC Ribbon Cable <https://www.sparkfun.com/products/8535> (PRT-08535); PROD_ID: CONN-08499; SF_ID: PRT-0778
L1 = rcl-buck:L-US: INDUCTOR, American symbol
R1-R8 R10-R18 R20-R27 = Resistor:R-US: Resistor Fixed - ANSI; CATEGORY: Resistor; SUB-CATEGORY: Fixed
S1 = SparkFun-Switches-Encoder:ENCODER-SWITCH: Rotary Encoder w/ Select Switch Encoders rotate similarly to potentiometers, but they’re different from potentiometers in that an encoder has full rotation without limits. They output gray code so that you can tell how much and in which direction the encoder has been turned. This encoder includes a push-down select switch built into the shaft. SparkFun Products Rotary Encoder <https://www.sparkfun.com/products/9117> (COM-09117); SF_SKU: COM-09117
SEN0 SEN1-SEN3 = BM08B-GHS-TBT_LF__SN__N_:BM08B-GHS-TBT(LF)(SN)(N): Conn Header Gh Top 8pos 1.25mm Check availability <https://pricing.snapeda.com/parts/BM08B-GHS-TBT%28LF%29%28SN%29%28N%29/JST%20Sales/view-part?ref=eda>; AVAILABILITY: In Stock; CHECK_PRICES: https://www.snapeda.com/parts/BM08B-GHS-TBT(LF)(SN)(N)/JST+Sales+America+Inc./view-part/?ref=eda; DESCRIPTION: Connector Header Surface Mount 8 position 0.049 (1.25mm); MF: JST Sales; MP: BM08B-GHS-TBT(LF)(SN)(N); PACKAGE: None; PRICE: None; SNAPEDA_LINK: https://www.snapeda.com/parts/BM08B-GHS-TBT(LF)(SN)(N)/JST+Sales+America+Inc./view-part/?ref=snap
U1 = 2024-09-23_20-06-51_Library:TPS54360DDAR; COPYRIGHT: Copyright (C) 2024 Ultra Librarian. All rights reserved.; MANUFACTURER_PART_NUMBER: TPS54360DDAR; MFR_NAME: Texas Instruments
U$1 = TEENSY-4.1_CLEAN:TEENSY_EXTENDED: Teensy Footprint Extended Mechanical footprint with connectors for Teensy Development Board with ARM Cortex. SparkFun Products: Teensy 4.1 <https://www.sparkfun.com/products/16771> Teensy 3.6 <https://www.sparkfun.com/products/14057> Teensy 3.5 <https://www.sparkfun.com/products/14055> SparkFun Qwiic Shield for Teensy Extended <https://www.sparkfun.com/products/17156> Teensy Stackable Header Kit (Longer Version) <https://www.sparkfun.com/products/17152>
U$2-U$4 = HX25418-4A:HX25418-4A